# Altium schematic sheet Motor.SchDoc
size A3; Organization: Altium Limited; Address1: L3, 12a Rodborough Rd; Address2: Frenchs Forest; Address3: NSW; Address4: Australia 2086
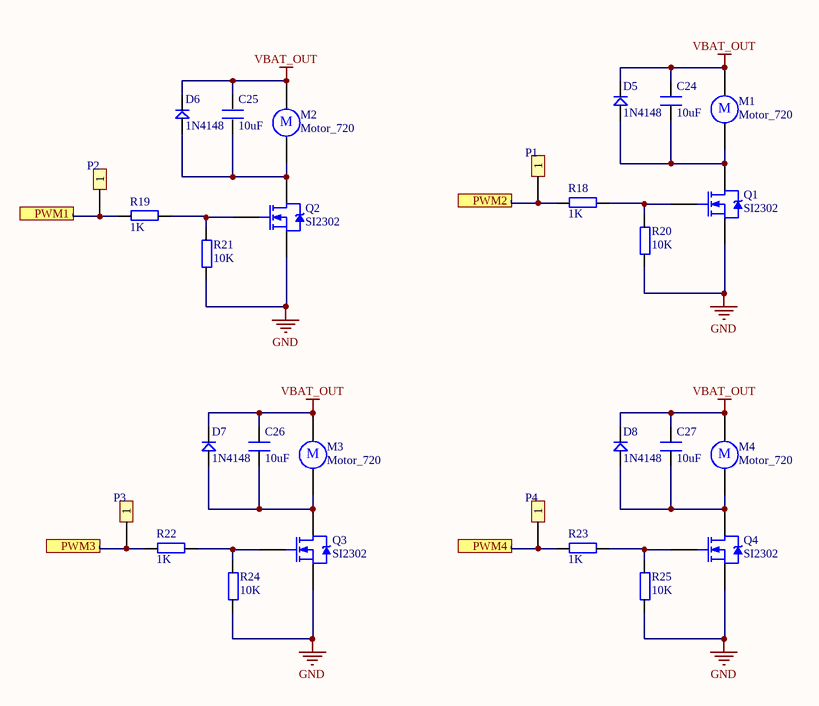
[diagram p0: Motor.SchDoc]

## Parts
C24  10uF  [0603P]
C25  10uF  [0603P]
C26  10uF  [0603P]
C27  10uF  [0603P]
D5  1N4148  [DIODE_SOP]
D6  1N4148  [DIODE_SOP]
D7  1N4148  [DIODE_SOP]
D8  1N4148  [DIODE_SOP]
M1  Motor_720  [MOTOR]
M2  Motor_720  [MOTOR]
M3  Motor_720  [MOTOR]
M4  Motor_720  [MOTOR]
P1  Header 1  [HEADER1]  (value not drawn)
P2  Header 1  [HEADER1]  (value not drawn)
P3  Header 1  [HEADER1]  (value not drawn)
P4  Header 1  [HEADER1]  (value not drawn)
Q1  SI2302  [SOT23-3M]
Q2  SI2302  [SOT23-3M]
Q3  SI2302  [SOT23-3M]
Q4  SI2302  [SOT23-3M]
R18  1K  [0603P]
R19  1K  [0603P]
R20  10K  [0603P]
R21  10K  [0603P]
R22  1K  [0603P]
R23  1K  [0603P]
R24  10K  [0603P]
R25  10K  [0603P]

## Ports
PWM1, PWM2, PWM3, PWM4

## Nets
GND: Q1.2(S) Q2.2(S) Q3.2(S) Q4.2(S) R20.1 R21.1 R24.1 R25.1
VBAT_OUT: C24.2 C25.2 C26.2 C27.2 D5.2 D6.2 D7.2 D8.2 M1.1 M2.1 M3.1 M4.1
PWM1: P2.1 R19.2 ; port PWM1
PWM2: P1.1 R18.2 ; port PWM2
PWM3: P3.1 R22.2 ; port PWM3
PWM4: P4.1 R23.2 ; port PWM4
NetC24_1: C24.1 D5.1 M1.2 Q1.3(D)
NetC25_1: C25.1 D6.1 M2.2 Q2.3(D)
NetC26_1: C26.1 D7.1 M3.2 Q3.3(D)
NetC27_1: C27.1 D8.1 M4.2 Q4.3(D)
NetQ1_1: Q1.1(G) R18.1 R20.2
NetQ2_1: Q2.1(G) R19.1 R21.2
NetQ3_1: Q3.1(G) R22.1 R24.2
NetQ4_1: Q4.1(G) R23.1 R25.2

## Notes on the sheet
- Title
- Size:
- Date:
- A3
- Number:
- Time:
- Revision:
- Sheet
- of
- File:
- (in symbol Motor_720) M

## Library data of the parts
C24-C27 = C
D5-D8 = D
M1-M4 = Motor_720: Motor, General Kind; Published: 8-August-2017; PackageReference: RB5-10.5; Publisher: mazhongwei
Q1-Q4 = SI2302: N-Channel Power MOSFET; Published: 8-August-2017; PackageReference: SOT23-3; Publisher: mazhongwei
R18-R25 = R
P1-P4 = Header 1: LatestRevisionDate: 17-Jul-2002; LatestRevisionNote: Re-released for DXP Platform.; Publisher: Altium Limited